# EAGLE design 98x Soldering Station v4.0  (EAGLE 9.6.1)
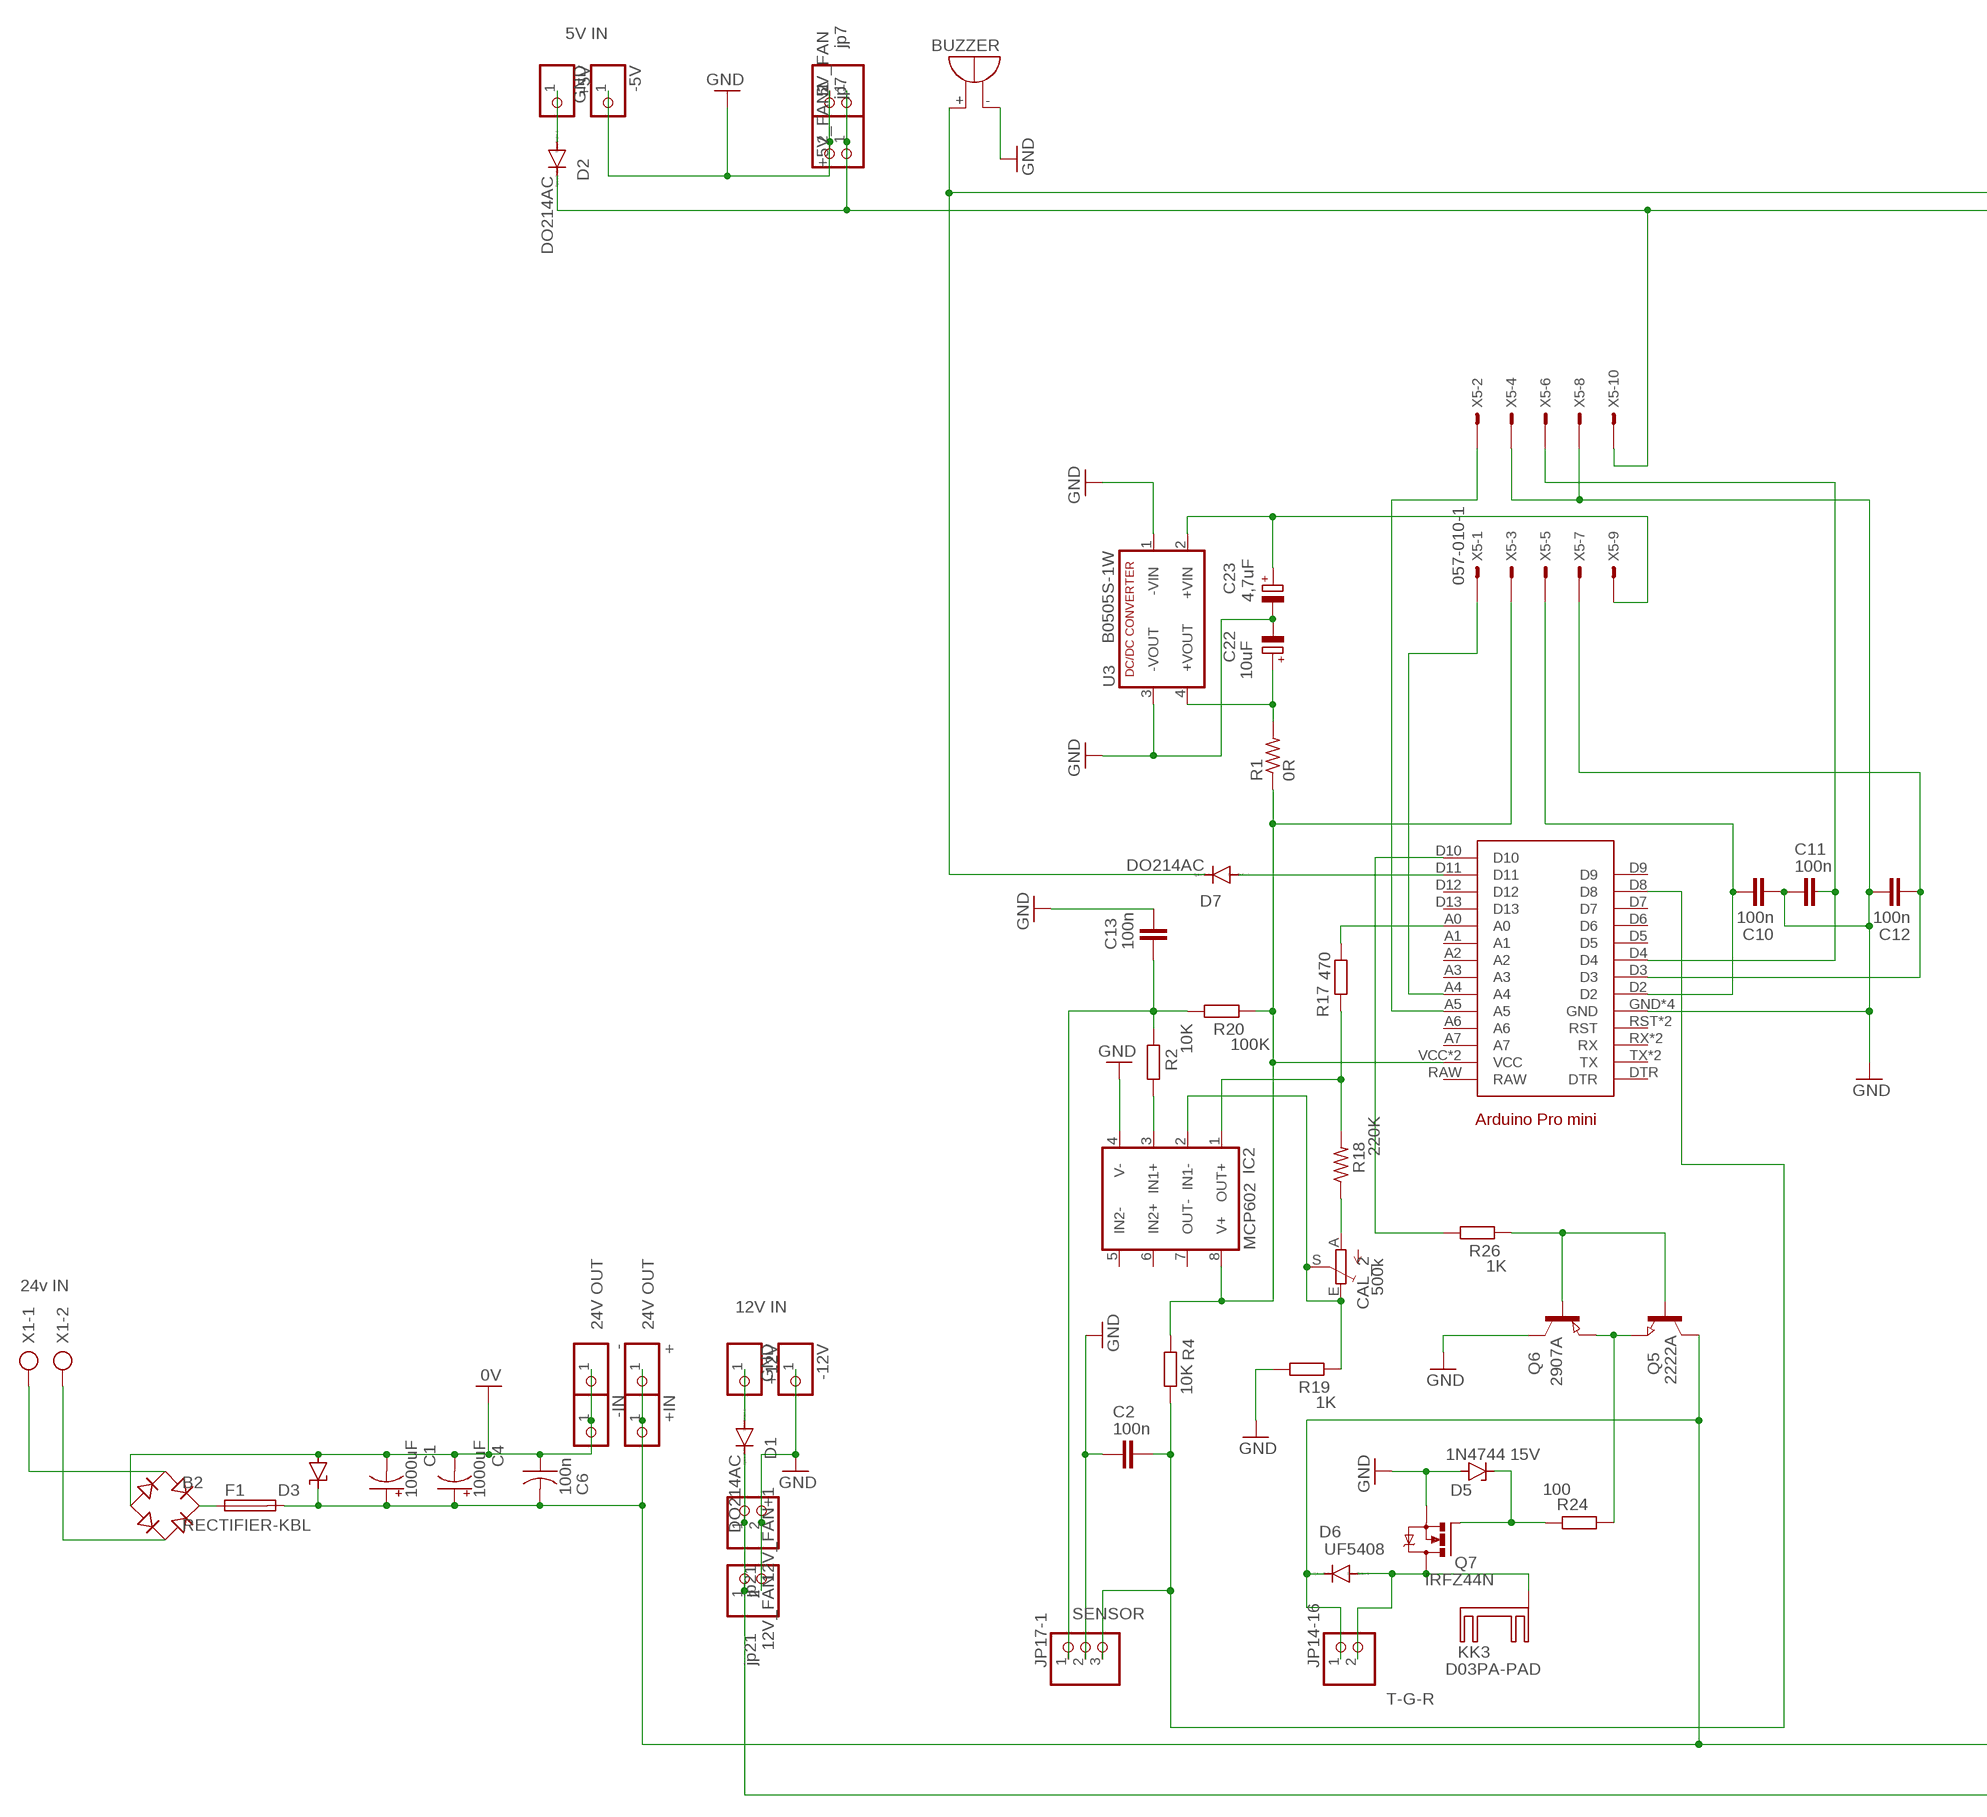
[diagram p0: schematic, sheet 1, part 1 of 2]
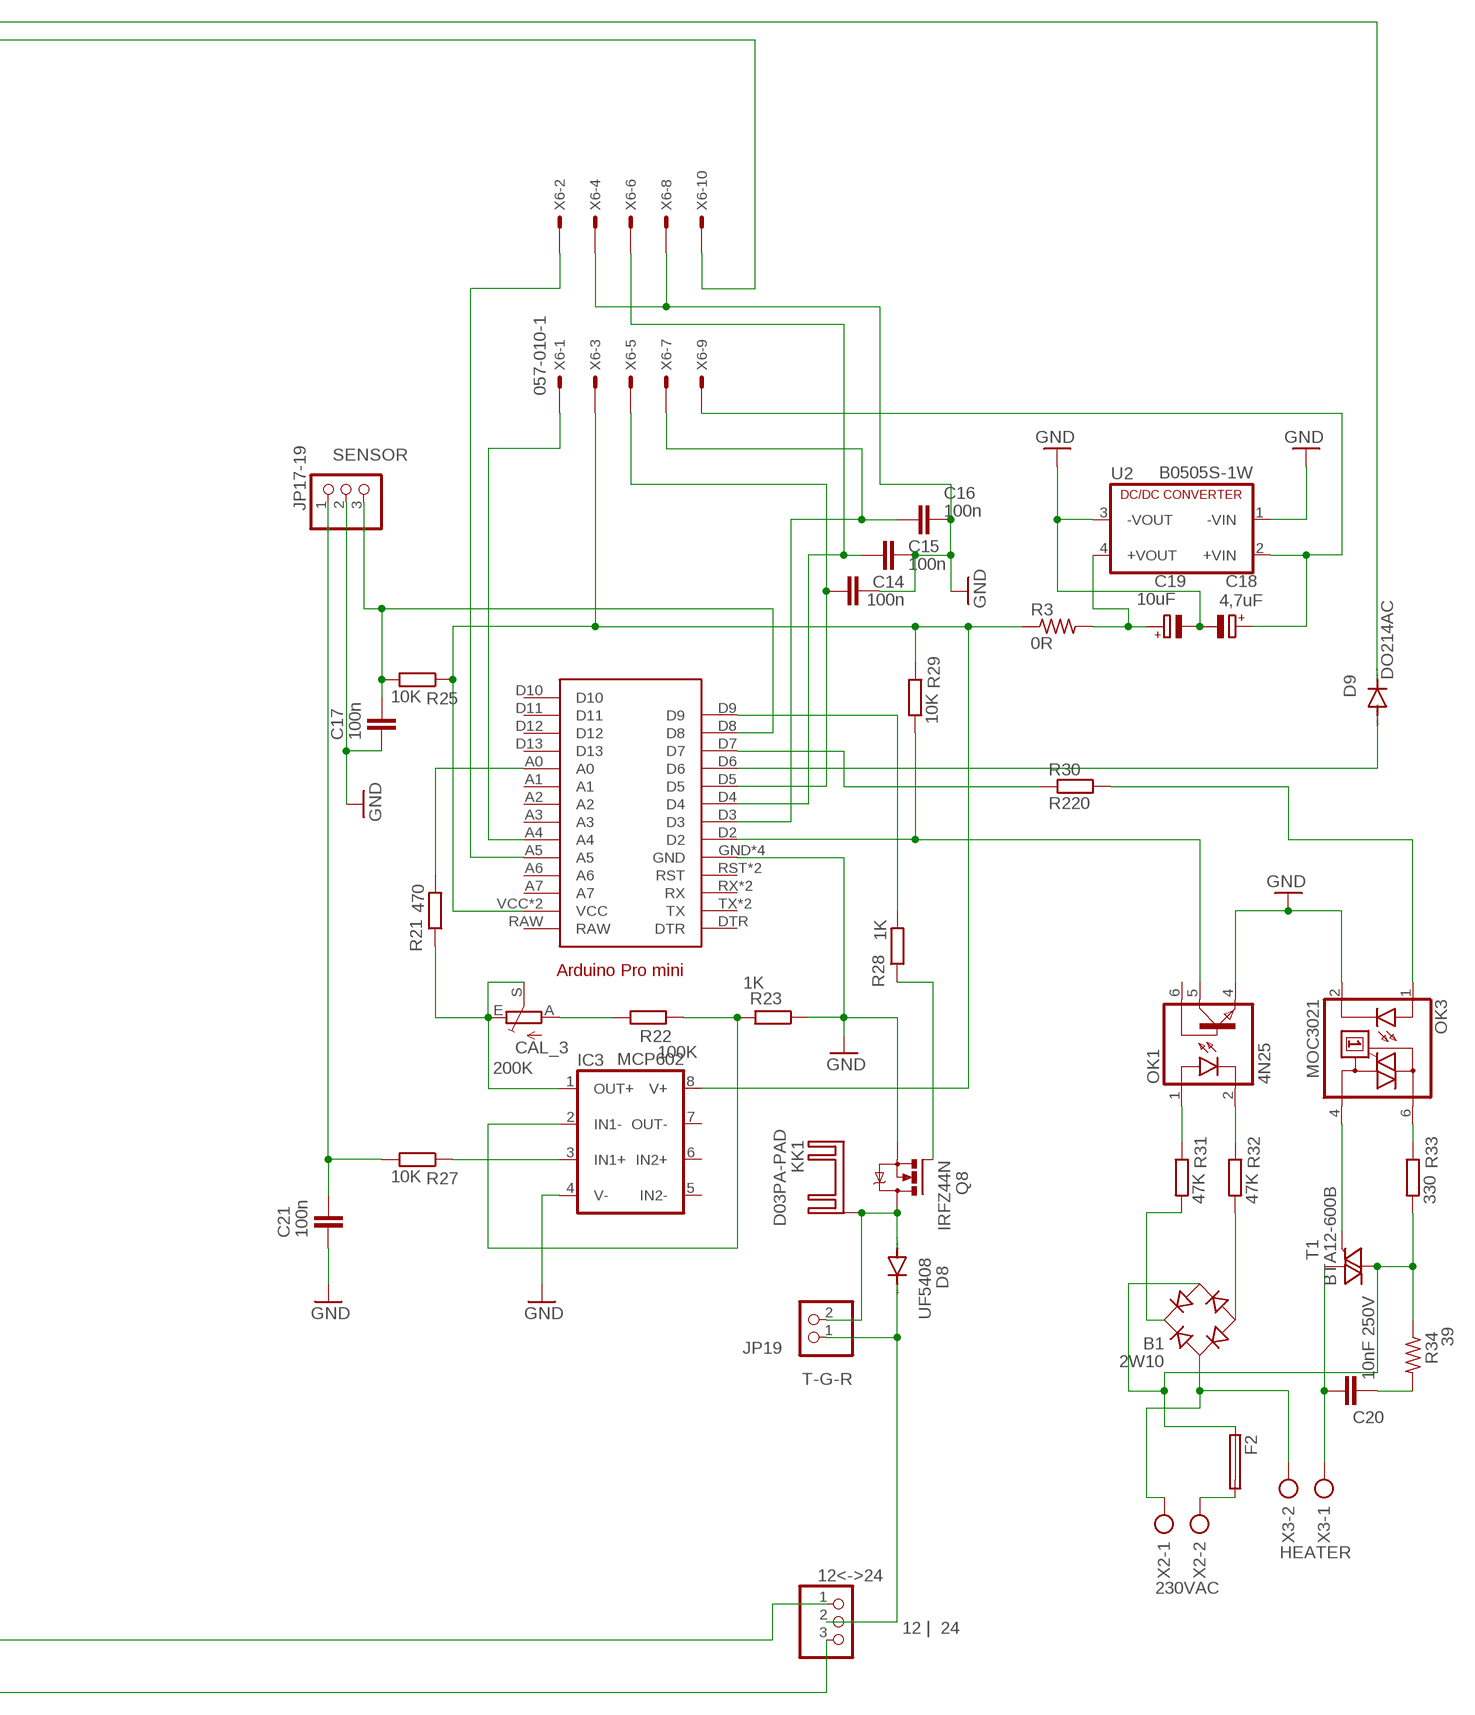
[diagram p1: schematic, sheet 1, part 2 of 2]

## Parts
5V_FAN  jp7  PINHD-1X2  [1X02]
12<->24  12 | 24  PINHD-1X3  [1X03]
12V_FAN  jp21  PINHD-1X2  [1X02]
12V_FAN+1  jp21  PINHD-1X2  [1X02]
+  24V OUT  PINHD-1X1  [1X01]
+5V  5V IN  PINHD-1X1  [1X01]
+5V_FAN1  jp7  PINHD-1X2  [1X02]
+12V  12V IN  PINHD-1X1  [1X01]
+IN  24V OUT  PINHD-1X1  [1X01]
-  GND  PINHD-1X1  [1X01]
-5V  GND  PINHD-1X1  [1X01]
-12V  GND  PINHD-1X1  [1X01]
-IN  GND  PINHD-1X1  [1X01]
ARDUINO2  907 solder  ARDUINO_PRO_MINI  [ARDUINO_PRO_MINI]
ARDUINO3  HotAir  ARDUINO_PRO_MINI  [ARDUINO_PRO_MINI]
B1  2W10  RB1A  [RB1A]
B2  RECTIFIER-KBL  [KBL]
BUZZER  BUZZER  F/TMB  [F/TMB]
C1  1000uF  CPOL-USE5-13  [E5-13]
C2  100n  C-EUC0805  [C0805]
C4  1000uF  CPOL-USE5-13  [E5-13]
C6  100n  C-USC1206K  [C1206K]
C10  100n  C-EUC0805  [C0805]
C11  100n  C-EUC0805  [C0805]
C12  100n  C-EUC0805  [C0805]
C13  100n  C-EUC0805  [C0805]
C14  100n  C-EUC0805  [C0805]
C15  100n  C-EUC0805  [C0805]
C16  100n  C-EUC0805  [C0805]
C17  100n  C-EUC0805  [C0805]
C18  4,7uF  CPOL-EUB/3528-21R  [B/3528-21R]
C19  10uF  CPOL-EUB/3528-21R  [B/3528-21R]
C20  10nF 250V  C10/4  [C10B4]
C21  100n  C-EUC0805  [C0805]
C22  10uF  CPOL-EUB/3528-21R  [B/3528-21R]
C23  4,7uF  CPOL-EUB/3528-21R  [B/3528-21R]
CAL_2  500k  TRIM_EU-S64W  [S64W]
CAL_3  200K  TRIM_EU-S64W  [S64W]
D1  DO214AC  DIODE-DO214AC  [DO214AC]
D2  DO214AC  DIODE-DO214AC  [DO214AC]
D3  SUPPRESSOR-SMBJ  [SMBJ]
D5  1N4744 15V  1N4728  [DO41Z10]
D6  UF5408  DIODE-SMC  [SMC]
D7  DO214AC  DIODE-DO214AC  [DO214AC]
D8  UF5408  DIODE-SMC  [SMC]
D9  DO214AC  DIODE-DO214AC  [DO214AC]
F1  TE5  [TE5]
F2  TE5  [TE5]
IC2  MCP602  [DIL08]
IC3  MCP602  [DIL08]
JP14-16  T-G-R  PINHD-1X2  [1X02]
JP17-1  SENSOR  PINHD-1X3  [1X03]
JP17-19  SENSOR  PINHD-1X3  [1X03]
JP19  T-G-R  PINHD-1X2  [1X02]
KK1  D03PA-PAD  [D03PA-PAD]
KK3  D03PA-PAD  [D03PA-PAD]
OK1  4N25  4N25M  [DIL06]
OK3  MOC3021  MOC3031M  [DIL06]
Q5  2222A  NPN-TRANSISTOR_SOT23  [SOT23]
Q6  2907A  PNP-TRANSISTOR_SOT23  [SOT23]
Q7  IRFZ44N  IRF540  [TO220BV]
Q8  IRFZ44N  IRF540  [TO220BV]
R1  0R  R-US_M0805  [M0805]
R2  10K  R-EU_R0805  [R0805]
R3  0R  R-US_M0805  [M0805]
R4  10K  R-EU_R0805  [R0805]
R17  470  R-EU_R0805  [R0805]
R18  220K  R-US_R0805  [R0805]
R19  1K  R-EU_R0805  [R0805]
R20  100K  R-EU_R0805  [R0805]
R21  470  R-EU_R0805  [R0805]
R22  100K  R-EU_R0805  [R0805]
R23  1K  R-EU_R0805  [R0805]
R24  100  R-EU_R0805  [R0805]
R25  10K  R-EU_R0805  [R0805]
R26  1K  R-EU_R0805  [R0805]
R27  10K  R-EU_R0805  [R0805]
R28  1K  R-EU_R0805  [R0805]
R29  10K  R-EU_R0805  [R0805]
R30  R220  R-EU_R0805  [R0805]
R31  47K  R-EU_M1206  [M1206]
R32  47K  R-EU_M1206  [M1206]
R33  330  R-EU_M1206  [M1206]
R34  39  R-US_0411/15  [0411/15]
T1  BTA12-600B  BT138-V  [TO220BV]
U2  B0505S-1W  VA-0505S  [4SIL]
U3  B0505S-1W  VA-0505S  [4SIL]
X1  24v IN  AK500/2-H  [AK500/2-H]
X2  230VAC  AK500/2-H  [AK500/2-H]
X3  HEATER  AK500/2-H  [AK500/2-H]
X5  057-010-1  [057-010-1]
X6  057-010-1  [057-010-1]

## Nets
0V: -.1 -IN.1 B2.- C1.- C4.- C6.1 D3.A
GND: 5V_FAN.2 12V_FAN+1.2 12V_FAN.2 +5V_FAN1.2 -5V.1 -12V.1 ARDUINO2.GND ARDUINO2.GND@1(GND) ARDUINO2.GND@2(GND) ARDUINO2.GND@3(GND) ARDUINO3.GND ARDUINO3.GND@1(GND) ARDUINO3.GND@2(GND) ARDUINO3.GND@3(GND) BUZZER.- C2.2 C10.2 C11.2 C12.1 C13.1 C14.2 C15.2 C16.2 C17.2 C18.- C19.- C21.2 C22.- C23.- D5.A IC2.4(V-) IC3.4(V-) JP17-1.2 JP17-19.2 OK1.4(EMI) OK3.2(C) Q6.3(C) Q7.S Q8.S R19.1 R23.1 U2.1(-VIN) U2.3(-VOUT) U3.1(-VIN) U3.3(-VOUT) X5.4 X5.8 X6.4 X6.8
N$1: D6.A JP14-16.2 KK3.B(K) Q7.D
N$2: B2.+ F1.1
N$3: 12<->24.3 12V_FAN+1.1 12V_FAN.1 D1.C
N$4: C22.+ R1.2 U3.4(+VOUT)
N$5: C19.+ R3.2 U2.4(+VOUT)
N$6: IC2.3(IN1+) R2.1
N$7: B2.AC2 X1.2
N$8: B2.AC1 X1.1
N$9: F2.2 X2.2
N$11: +12V.1 D1.A
N$12: +5V.1 D2.A
N$14: ARDUINO2.D8 C2.1 JP17-1.3 R4.2
N$15: 12<->24.1 +.1 +IN.1 C1.+ C4.+ C6.2 D3.C D6.C F1.2 JP14-16.1 Q5.3(C)
N$18: ARDUINO2.A4 X5.1
N$19: ARDUINO2.A5 X5.2
N$21: BUZZER.+ D7.C D9.C
N$22: ARDUINO3.D7 R30.2
N$23: ARDUINO2.D3 C12.2 X5.7
N$26: C23.+ U3.2(+VIN) X5.9
N$35: Q5.2(E) Q6.2(E) R24.1
N$38: C18.+ U2.2(+VIN) X6.9
N$39: 12<->24.2 D8.C JP19.1
N$40: 5V_FAN.1 +5V_FAN1.1 D2.C X5.10 X6.10
N$44: IC2.1(OUT+) R17.1 R18.2
N$45: ARDUINO2.D2 C10.1 X5.5
N$46: ARDUINO2.D4 C11.1 X5.6
N$48: ARDUINO2.D11 D7.A
N$51: ARDUINO2.A0 R17.2
N$52: ARDUINO3.A0 R21.2
N$53: CAL_2.A R18.1
N$54: CAL_2.E CAL_2.S IC2.2(IN1-) R19.2
N$55: CAL_3.E CAL_3.S IC3.1(OUT+) R21.1
N$56: C13.2 JP17-1.1 R2.2 R20.1
N$57: ARDUINO2.D10 R26.1
N$58: Q5.1(B) Q6.1(B) R26.2
N$59: D5.C Q7.G R24.2
N$60: CAL_3.A R22.1
N$61: ARDUINO3.D8 C17.1 JP17-19.3 R25.2
N$62: ARDUINO3.D5 C14.1 X6.5
N$63: ARDUINO3.D4 C15.1 X6.6
N$64: ARDUINO3.D3 C16.1 X6.7
N$66: ARDUINO3.A4 X6.1
N$67: ARDUINO3.A5 X6.2
N$68: ARDUINO3.D9 R28.2
N$69: IC3.2(IN1-) R22.2 R23.2
N$70: IC3.3(IN1+) R27.1
N$71: C21.1 JP17-19.1 R27.2
N$72: D8.A JP19.2 KK1.B(K) Q8.D
N$73: OK3.4(A1) T1.G
N$74: Q8.G R28.1
N$75: ARDUINO3.D2 OK1.5(COL) R29.2
N$76: ARDUINO3.D6 D9.A
N$78: ARDUINO3.VCC ARDUINO3.VCC@1(VCC) IC3.8(V+) R3.1 R25.1 R29.1 X6.3
N$79: OK3.1(A) R30.1
N$80: OK3.6(A2) R33.1
N$81: B1.AC2 F2.1 R33.2 R34.1 T1.T2(A2)
N$82: OK1.2(C) R32.1
N$83: OK1.1(A) R31.1
N$84: B1.+ R31.2
N$85: B1.- R32.2
N$86: C20.1 T1.T1(A1) X3.1
N$87: C20.2 R34.2
N$88: B1.AC1 X2.1 X3.2
N$92: ARDUINO2.VCC ARDUINO2.VCC@1(VCC) IC2.8(V+) R1.1 R4.1 R20.2 X5.3
Unconnected: ARDUINO2.A1 ARDUINO2.A2 ARDUINO2.A3 ARDUINO2.A6 ARDUINO2.A7 ARDUINO2.D5 ARDUINO2.D6 ARDUINO2.D7 ARDUINO2.D9 ARDUINO2.D12 ARDUINO2.D13 ARDUINO2.DTR ARDUINO2.RAW ARDUINO2.RST ARDUINO2.RST@1(RST) ARDUINO2.RX ARDUINO2.RX@1(RX) ARDUINO2.TX ARDUINO2.TX@1(TX) ARDUINO3.A1 ARDUINO3.A2 ARDUINO3.A3 ARDUINO3.A6 ARDUINO3.A7 ARDUINO3.D10 ARDUINO3.D11 ARDUINO3.D12 ARDUINO3.D13 ARDUINO3.DTR ARDUINO3.RAW ARDUINO3.RST ARDUINO3.RST@1(RST) ARDUINO3.RX ARDUINO3.RX@1(RX) ARDUINO3.TX ARDUINO3.TX@1(TX) IC2.5(IN2-) IC2.6(IN2+) IC2.7(OUT-) IC3.5(IN2-) IC3.6(IN2+) IC3.7(OUT-) OK1.6(BAS)

## Library data of the parts
5V_FAN 12V_FAN 12V_FAN+1 +5V_FAN1 JP14-16 JP19 = pinhead:PINHD-1X2: PIN HEADER
12<->24 JP17-1 JP17-19 = pinhead:PINHD-1X3: PIN HEADER
+ +5V +12V +IN - -5V -12V -IN = pinhead:PINHD-1X1: PIN HEADER
ARDUINO2 ARDUINO3 = arduinopromini:ARDUINO_PRO_MINI: For creating Arduino Pro Mini shields
B1 = rectifier:RB1A: RECTIFIER 1 A
B2 = rectifier:RECTIFIER-: Rectifier
BUZZER = buzzer:F/TMB: BUZZER Source: Buerklin; OC_FARNELL: unknown; OC_NEWARK: unknown
C1 C4 = rcl:CPOL-US: POLARIZED CAPACITOR, American symbol; SPICEPREFIX: C
C2 C10-C17 C21 = rcl:C-EU: CAPACITOR, European symbol; SPICEPREFIX: C
C6 = rcl:C-US: CAPACITOR, American symbol; SPICEPREFIX: C
C18 C19 C22 C23 = rcl:CPOL-EU: POLARIZED CAPACITOR, European symbol; SPICEPREFIX: C
C20 = capacitor-wima:C: CAPACITOR naming: grid - package width
CAL_2 CAL_3 = pot:TRIM_EU-: POTENTIOMETER
D1 D2 D6-D9 = diode:DIODE-: DIODE
D3 = diode:SUPPRESSOR-: Suppressor diode
D5 = diode:1N4728: Z DIODE 3.3 V, 1W, 5 percent
F1 F2 = fuse:TE5: FUSE Wickmann; OC_FARNELL: unknown; OC_NEWARK: unknown
IC2 IC3 = MCP602dip:MCP602: Single Op Amp 2.7V to 6.0V Single Supply CMOS Source: http://ww1.microchip.com/downloads/en/DeviceDoc/21314g.pdf
KK1 KK3 = heatsink:D03PA-PAD: HEATSINK distributor Schukat
OK1 = optocoupler:4N*?M: General Purpose 6-Pin Phototransistor Optocouplers Source: http://www.fairchildsemi.com/ds/4N/4N35-M.pdf; MPN: 4N25-M; OC_FARNELL: 1021349; OC_NEWARK: 98K9084
OK3 = optocoupler:MOC30*: 6-Pin DIP Zero-Cross Optoisolators Triac Driver Output (250/400 Volt Peak) Source: Data sheet <http://www.fairchildsemi.com/ds/MO/MOC3031M.pdf> The old path of data sheet not more available 2013-05-06.; MF: FAIRCHILD SEMICONDUCTOR; MPN: MOC3031M; OC_FARNELL: 9875964; OC_NEWARK: 78K6089
Q5 = semicon-smd-ipc:NPN-TRANSISTOR_: NPN TRANSISTOR
Q6 = semicon-smd-ipc:PNP-TRANSISTOR_: PNP TRANSISTOR
Q7 Q8 = transistor-power:IRF540: HEXFET Power MOSFET
R1 R3 R18 R34 = rcl:R-US_: RESISTOR, American symbol; SPICEPREFIX: R
R2 R4 R17 R19-R33 = rcl:R-EU_: RESISTOR, European symbol; SPICEPREFIX: R
T1 = triac:BT138: TRIAC Source: http://www.semiconductors.philips.com BT138_SERIES_2.pdf
U2 U3 = dc-dc-converter:VA-*?: DC DC Converter Single Output, 1 Watt Motien Technology Co.,Ltd. Source: Data sheet <http://www.motien.com.tw/data_sheet/VA-1%28H%29.pdf>; OC_FARNELL: unknown; OC_NEWARK: unknown
X1-X3 = con-ptr500:AK500/2-H: CONNECTOR Aug. 2004 / PTR Meßtechnik: Die Bezeichnung der Serie AK505 wurde geändert. Es handelt sich hierbei um AK500 in horizontaler Ausführung.; OC_FARNELL: unknown; OC_NEWARK: unknown
X5 X6 = con-panduit:057-010-: CONNECTOR 10-pin series 057 contact pc board low profile headers; OC_FARNELL: unknown; OC_NEWARK: unknown

## Board
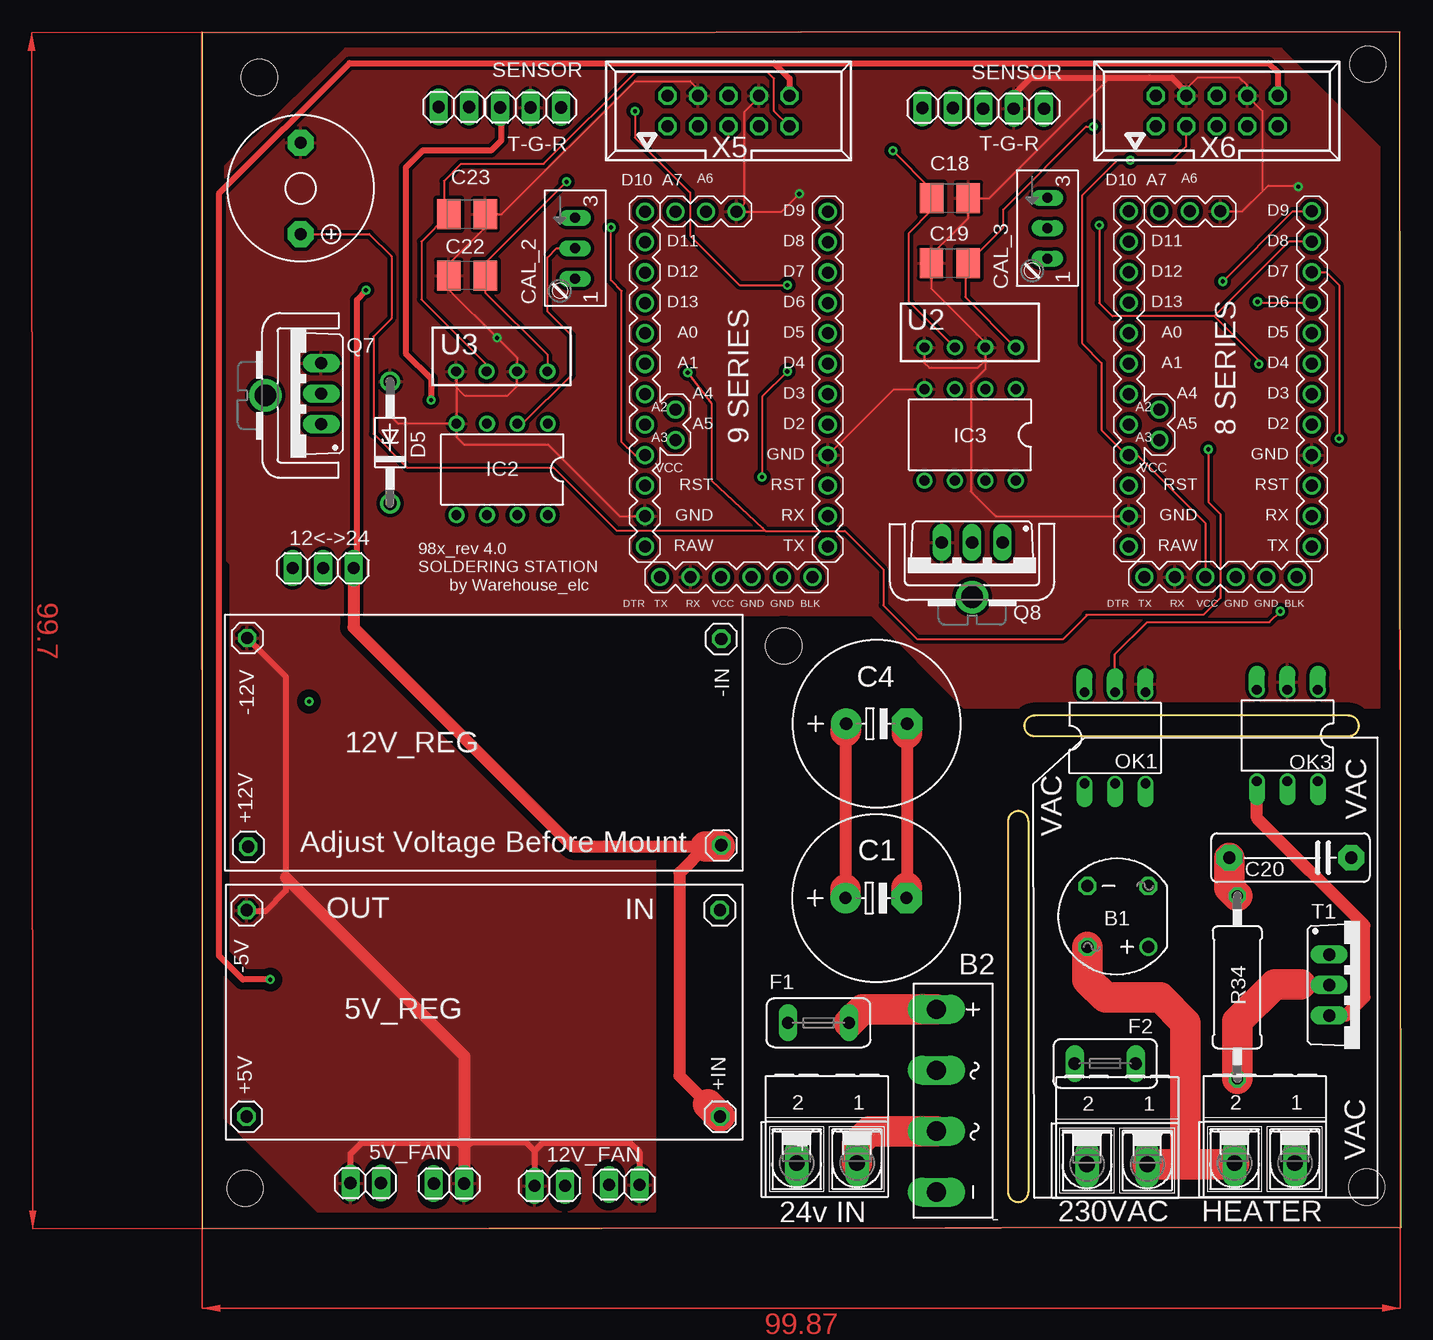
[diagram p2: board, top side]
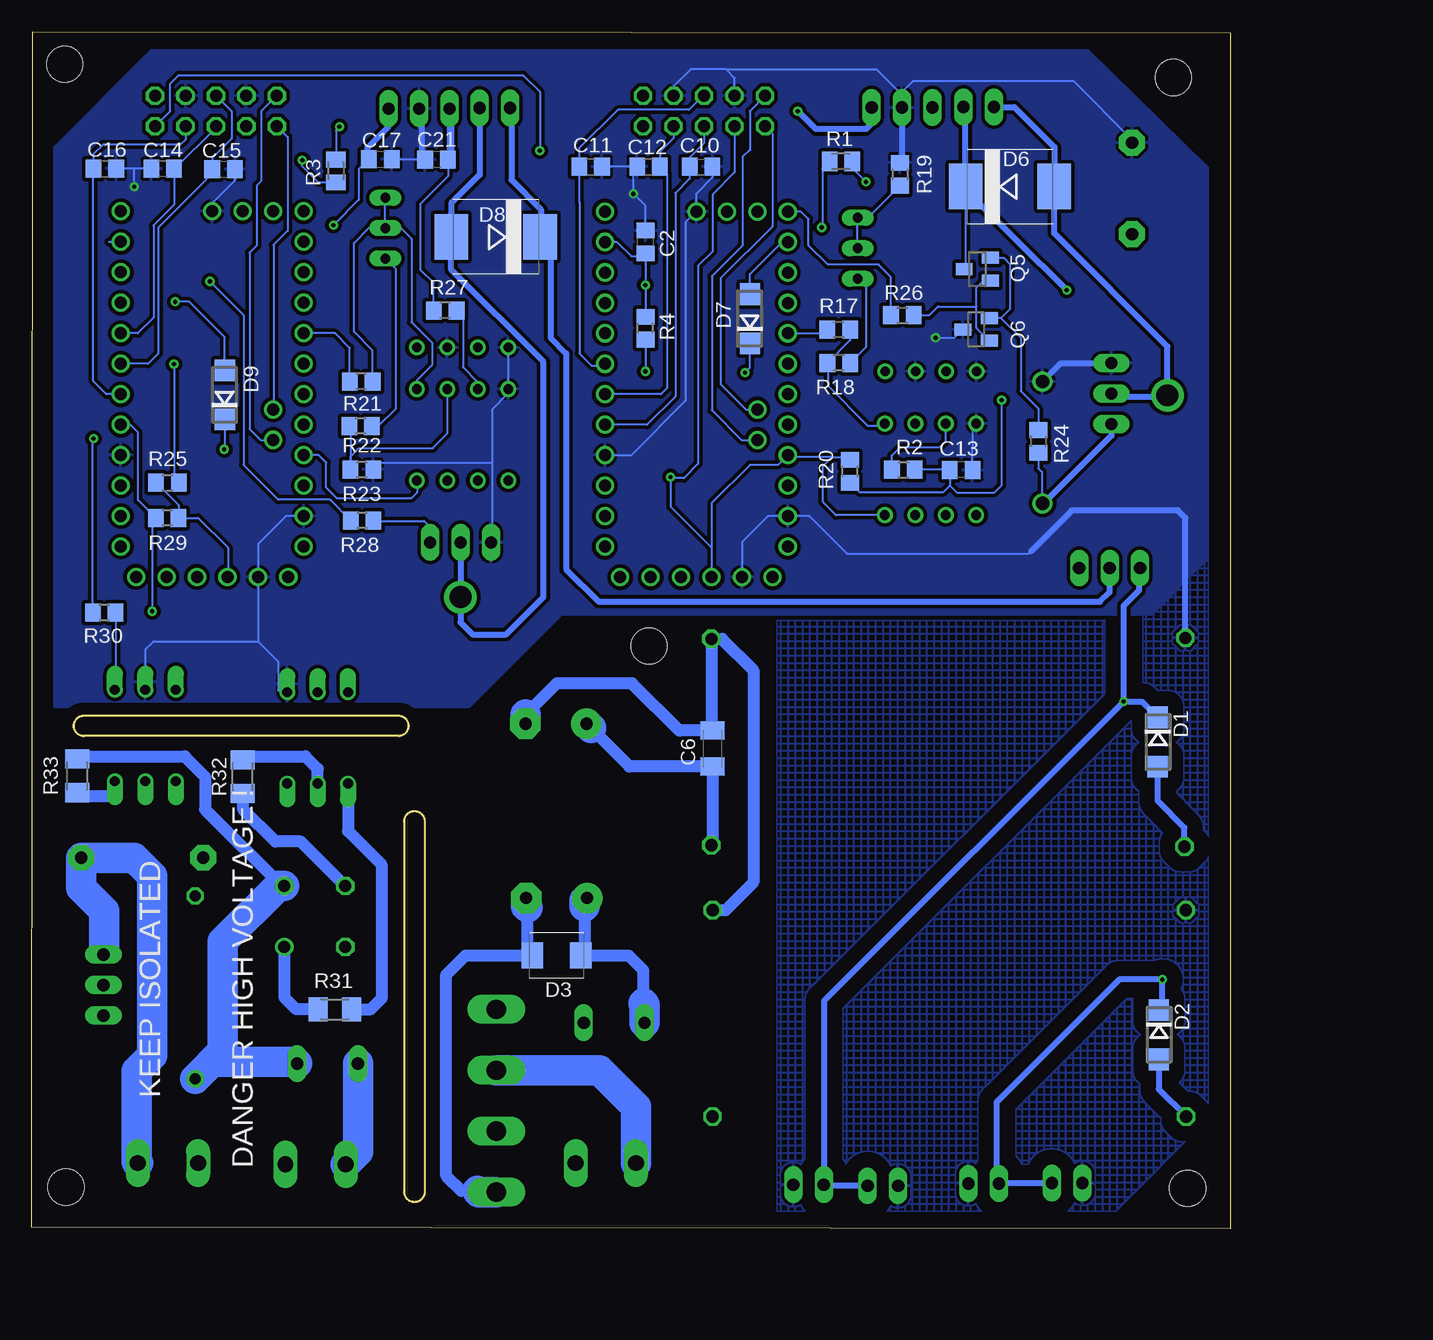
[diagram p3: board, bottom side, seen from below]

Size 99.93 x 99.8 mm. Coordinates in mm from the lower left corner, seen from the top.
Outline: 0,0 99.93,0.1 99.83,99.8 0,99.7 0,0
Outline: 95.56,42.77 69.36,42.77 arc180 69.36,41.07 95.56,41.07 arc180 95.56,42.77
Outline: 68.86,33.97 arc180 67.16,33.97 67.16,3.07 arc180 68.86,3.07 68.86,33.97
Copper layers (1*16): Top 0.035mm / dielectric 1.5mm / Bottom 0.035mm
Design rules "default": minimum track width 6mil, minimum drill 0.35mm, track to track 6mil, track to pad 6mil, pad to pad 6mil, via to via 6mil, smd to smd 6mil, copper to edge 40mil, drill to drill 6mil, minimum pad ring 10mil, minimum via ring 8mil, stop-mask expansion 4mil, vias tented up to drill 0mil, thermal gap 10mil
Holes 3 mm at 4.76,95.97 48.46,48.57 97.06,3.47 3.56,3.37 97.16,97.07

### Footprints (pad centres in the part's own frame; a part is rotated, then mirrored left to right if it is on the bottom)
1X02 = drill 1.016 long: 1 -1.27,0; 2 1.27,0
1X03 = drill 1.016 long: 1 -2.54,0; 2 0,0; 3 2.54,0
1X01 = drill 1.016 octagon: 1 0,0
ARDUINO_PRO_MINI = drill 1: A0 11.43,-8.89; A1 11.43,-6.35; A2 11.43,-3.81; A3 11.43,-1.27; A4 8.89,-2.54; A5 8.89,0; A6 6.35,-19.05; A7 8.89,-19.05; BLK 10.16,11.43; D2 -3.81,-1.27; D3 -3.81,-3.81; D4 -3.81,-6.35; D5 -3.81,-8.89; D6 -3.81,-11.43; D7 -3.81,-13.97; D8 -3.81,-16.51; D9 -3.81,-19.05; D10 11.43,-19.05; D11 11.43,-16.51; D12 11.43,-13.97; D13 11.43,-11.43; DTR -2.54,11.43; GND -3.81,1.27; GND@1 11.43,6.35; GND@2 7.62,11.43; GND@3 3.81,-19.05; RAW 11.43,8.89; RST 11.43,3.81; RST@1 -3.81,3.81; RX -3.81,6.35; RX@1 2.54,11.43; TX -3.81,8.89; TX@1 0,11.43; VCC 11.43,1.27; VCC@1 5.08,11.43
RB1A = drill 1.016: + -2.54,2.54 | drill 1.016 octagon: - 2.54,-2.54; AC1 2.54,2.54; AC2 -2.54,-2.54
KBL = drill 1.6 long: + -7.62,-1.27; - 7.62,-1.27; AC1 2.54,-1.27; AC2 -2.54,-1.27
F/TMB = drill 1.016 pad 2.159 octagon: + 3.81,0; - -3.81,0
E5-13 = drill 1.016 pad 2.54: + -2.54,0 | drill 1.016 pad 2.54 octagon: - 2.54,0
C0805 = smd 1.3 x 1.5: 1 -0.95,0; 2 0.95,0
C1206K = smd 1.5 x 2: 1 -1.5,0; 2 1.5,0
B/3528-21R = smd 1.95 x 2.5: + 1.525,0; - -1.525,0
C10B4 = drill 1.016 pad 2.159 octagon: 1 -5.08,0; 2 5.08,0
S64W = drill 0.813 long: A 2.54,1.27; E -2.54,1.27; S 0,1.27
DO214AC = smd 1.8 x 1.7: A 2.05,0; C -2.05,0
SMBJ = smd 1.78 x 2.16: A 2.04,0; C -2.03,0
DO41Z10 = drill 1.118: A 5.08,0; C -5.08,0
SMC = smd 2.8 x 3.8: A 3.7,0; C -3.7,0
TE5 = drill 1.016 long: 1 -2.54,0; 2 2.54,0
DIL08 = drill 0.813 pad 1.27: 1 -3.81,-3.81; 2 -1.27,-3.81; 3 1.27,-3.81; 4 3.81,-3.81; 5 3.81,3.81; 6 1.27,3.81; 7 -1.27,3.81; 8 -3.81,3.81
D03PA-PAD = drill 1.803 pad 2.54: B 0,-1.016
DIL06 = drill 0.813 offset: 1 -2.54,-3.81; 2 0,-3.81; 3 2.54,-3.81; 4 2.54,3.81; 5 0,3.81; 6 -2.54,3.81
SOT23 = smd 1 x 1.4: 1 -0.95,-1.1; 2 0.95,-1.1; 3 0,1.1
TO220BV = drill 1.016 long: D 0,-2.54; G -2.54,-2.54; S 2.54,-2.54
M0805 = smd 1.3 x 1.6: 1 -0.95,0; 2 0.95,0
R0805 = smd 1.3 x 1.5: 1 -0.95,0; 2 0.95,0
M1206 = smd 1.6 x 2: 1 -1.4,0; 2 1.4,0
0411/15 = drill 0.914 octagon: 1 -7.62,0; 2 7.62,0
TO220BV' = drill 1.016 long: G 2.54,-2.54; T1 -2.54,-2.54; T2 0,-2.54
4SIL = drill 0.8: 1 -3.81,0; 2 -1.27,0; 3 1.27,0; 4 3.81,0
AK500/2-H = drill 1.321 long: 1 -2.515,0; 2 2.515,0
057-010-1 = drill 1 octagon: 1 -5.08,-1.27; 2 -5.08,1.27; 3 -2.54,-1.27; 4 -2.54,1.27; 5 0,-1.27; 6 0,1.27; 7 2.54,-1.27; 8 2.54,1.27; 9 5.08,-1.27; 10 5.08,1.27

### Placement (x,y rotation side)
5V_FAN  13.61,3.8 180 top
12<->24  10.06,55.07 180 top
12V_FAN  28.96,3.57 180 top
12V_FAN+1  35.16,3.67 0 top
+  43.16,9.35 90 top
+5V  3.68,9.35 90 top
+5V_FAN1  20.56,3.77 0 top
+12V  3.82,31.85 90 top
+IN  43.26,31.97 90 top
-  43.14,26.55 90 top
-5V  3.7,26.55 90 top
-12V  3.74,49.25 90 top
-IN  43.26,49.17 90 top
ARDUINO2  48.32,65.75 180 top
ARDUINO3  88.68,65.76 180 top
B1  76.32,26.03 180 top
B2  62.46,10.67 270 top
BUZZER  8.19,86.73 270 top
C1  56.16,27.57 0 top
C2  48.76,82.27 90 bottom
C4  56.21,42.1 0 top
C6  43.15,40.02 270 bottom
C10  44.12,88.52 0 bottom
C11  53.32,88.54 0 bottom
C12  48.5,88.54 0 bottom
C13  22.43,63.26 180 bottom
C14  89,88.35 180 bottom
C15  83.92,88.33 0 bottom
C16  93.82,88.37 0 bottom
C17  70.85,89.17 0 bottom
C18  62.32,85.92 180 top
C19  62.3,80.5 0 top
C20  90.7,30.93 180 top
C21  66.17,89.13 180 bottom
C22  22.06,79.47 0 top
C23  22.06,84.57 180 top
CAL_2  29.8,81.74 270 top
CAL_3  69.17,83.41 270 top
D1  6.06,40.57 270 bottom
D2  5.96,16.17 270 bottom
D3  56.16,22.77 180 bottom
D5  15.65,65.54 90 top
D6  18.37,86.88 0 bottom
D7  40.04,75.86 90 bottom
D8  61.24,82.68 180 bottom
D9  83.82,69.51 90 bottom
F1  51.36,17.17 180 top
F2  75.26,13.77 180 top
IC2  24.99,63.3 180 top
IC3  64,66.18 180 top
JP14-16  20.97,93.51 180 top
JP17-1  27.36,93.47 0 top
JP17-19  67.63,93.38 0 top
JP19  61.3,93.43 0 top
KK1  64.17,53.67 0 top
KK3  6.26,69.47 270 top
OK1  76.08,40.92 0 top
OK3  90.45,41.12 180 top
Q5  21.09,79.99 90 bottom
Q6  21.19,74.97 90 bottom
Q7  7.37,69.61 90 top
Q8  64.17,54.67 180 top
R1  32.46,88.97 0 bottom
R2  27.26,63.27 0 bottom
R3  74.56,88.17 90 bottom
R4  48.76,75.07 90 bottom
R17  32.64,74.95 180 bottom
R18  32.63,72.18 180 bottom
R19  27.53,87.9 270 bottom
R20  31.71,63.14 90 bottom
R21  72.45,70.63 180 bottom
R22  72.5,66.91 180 bottom
R23  72.4,63.27 180 bottom
R24  16,65.63 270 bottom
R25  88.6,62.19 0 bottom
R26  27.34,76.14 0 bottom
R27  65.45,76.55 180 bottom
R28  72.37,59.03 180 bottom
R29  88.62,59.25 180 bottom
R30  93.87,51.35 180 bottom
R31  74.65,18.29 180 bottom
R32  82.32,37.68 270 bottom
R33  96.14,37.75 90 bottom
R34  86.28,20.13 90 top
T1  BTA12-600B  [TO220BV']  96.47,20.31 270 top
U2  64,73.47 0 top
U3  24.96,71.47 0 top
X1  52.06,5.47 180 top
X2  76.26,5.37 180 top
X3  88.56,5.47 180 top
X5  43.86,93.17 0 top
X6  84.56,93.17 0 top

### Tracks (layer width: path | path; a pad name or v marks a point on that pad's centre or on a via)
0V
  Top 1.016: 58.75,41.27 58.75,28.47
  Top 2.54: C1.- 58.7,28.42 58.75,28.47 | C4.- 58.75,41.27
  Bottom 1.016: -.1 42.08,26.55 39.76,28.87 39.76,46.57 42.36,49.17 -IN.1 43.26,41.63 C6.1 45.91,41.52 49.86,45.47 56.16,45.47 58.75,42.88 | 62.76,3.15 64.09,3.15 65.36,4.42 65.36,21.17 63.76,22.77 D3.A 58.6,23.17 58.6,26.77
  Bottom 2.54: 62.76,3.15 62.66,3.05 B2.- | C1.- 58.7,26.87 58.6,26.77 | C4.- 58.75,42.88
GND  (via drill 0.35)
  Top 0.152: 20.66,79.59 20.66,80.52 23.58,83.44 C23.- | C22.- 20.66,79.59 | 20.66,79.59 20.66,78.17 v24.56,74.27 26.23,72.6 U3.3 26.23,70.24 25.46,69.47 21.85,69.47 21.15,70.17 U3.1 21.18,71.44 IC2.4 | 88.36,86.47 88.36,93.18 X6.8 87.1,95.33 86.46,95.97 82.96,95.97 82.02,95.03 82.02,94.97 X6.4 | 88.36,86.47 88.86,86.97 91.26,86.97 v91.36,86.87 | 88.36,86.47 86.7,84.81 ARDUINO3.GND@3 | C19.- 60.47,80.8 | 81.92,94.87 81.92,95.07 | 65.27,72.37 U2.3 65.27,73.87 64.57,74.57 64.56,74.57 60.76,78.37 60.76,80.48 C19.- | 65.27,72.37 65.27,71.67 64.06,70.46 64.06,61.47 66.12,59.41 ARDUINO3.GND@1 | ARDUINO3.GND 92.29,64.69 | 60.26,79.98 C19.- | X5.8 46.4,94.31 45.16,93.07 45.16,85.42 44.51,84.77 ARDUINO2.GND@3 48.29,84.8 v49.76,86.27 | 52.36,64.48 ARDUINO2.GND 57.64,69.99 IC3.4 | C19.- 60.77,81.19 63.84,84.25 C18.- 65.61,85.92 75.66,95.97 78.96,95.97 | IC2.4 21.18,67.07 | D5.A 15.65,67.78 16.32,67.11 IC2.4 | IC2.4 21.18,66.01 21.82,65.37 28.82,65.37 34.79,59.4 ARDUINO2.GND@1 | 24.46,84.57 C23.- | C23.- 24.96,84.57 36.06,95.67 40.66,95.67 41.32,95.01 X5.4 | U2.1 60.19,72.17 60.59,71.77 64.67,71.77 65.27,72.37
  Top 0.508: JP17-19.2 67.63,94.54 69.06,95.97 78.96,95.97 80.82,95.97 81.92,94.87 | 81.92,95.07 82.02,94.97 | -12V.1 6.96,46.03 6.96,29.27 6.96,28.17 5.26,26.47 3.78,26.47 -5V.1 | 27.69,6.5 27.02,7.17 22.4,7.17 21.83,6.6 | 27.69,6.5 28.36,7.17 35.66,7.17 36.43,6.4 12V_FAN+1.2 | 27.69,6.5 12V_FAN.2 | 5V_FAN.2 12.34,6.25 13.26,7.17 21.26,7.17 21.83,6.6 | 21.83,6.6 +5V_FAN1.2
  Top 1.016: 6.96,29.27 21.83,14.4 +5V_FAN1.2
  Bottom 0.152: X5.4 41.32,95.93 42.06,96.67 | 42.06,96.67 44.96,96.67 46.4,95.23 X5.8 | 42.06,96.67 29.51,96.67 27.36,94.52 JP17-1.2 | U2.1 IC3.4 60.19,69.64 61.56,68.27 61.56,63.87 | Q8.S 61.56,57.21 61.56,63.87 | ARDUINO3.GND@1 78.72,59.41 81.06,57.07 ARDUINO3.GND@2 81.06,48.97 | R23.1 70.85,63.87 61.56,63.87 | Q6.3 22.99,74.27 v24.56,74.27 | OK1.4 79.31,45.31 79.36,44.83 79.36,47.27 81.06,48.97 | OK3.2 90.45,48.28 89.76,48.97 81.06,48.97 | 67.86,93.15 JP17-19.2 67.63,94.44 | 67.63,89.64 C21.2 | C21.2 67.17,89.08 | C14.2 91.36,88.35 | 91.36,88.35 92.85,88.35 C16.2 | ARDUINO3.GND@3 84.87,85.51 82.97,87.41 C15.2 | v91.36,86.87 91.36,88.35 | C12.1 49.76,88.54 | 49.76,88.54 C11.2 | C10.2 43.17,87.64 44.51,86.3 ARDUINO2.GND@3 45.41,83.9 45.41,69.02 49.96,64.47 ARDUINO2.GND | 49.76,88.54 v49.76,86.27 48.76,85.27 C2.2 | C13.1 21.45,66.84 IC2.4 | ARDUINO2.GND@2 40.7,57.23 38.53,59.4 ARDUINO2.GND@1 35.09,59.4 31.96,56.27 16.81,56.27 16.61,56.47 | BUZZER.- 8.19,90.8 13.06,95.67 26.46,95.67 27.53,94.6 27.53,94.07 27.53,93.5 | C21.2 69.86,89.13 C17.2
  Bottom 0.508: JP17-19.2 67.43,93.18 67.43,89.34 67.17,89.08 | D5.A 14.12,72.15 Q7.S | -12V.1 3.74,59.25 4.36,59.87 13.21,59.87 16.61,56.47 | R19.1 27.36,89.02 JP17-1.2 27.53,93.64 27.53,94.07
  pour Top (isolate 0.305): 11.88,98.37 1.86,88.58 1.86,55.87 6.56,51.17 55.76,51.17 63.46,43.47 98.16,43.47 98.16,90.17 89.96,98.37
  pour Bottom (isolate 0.305): 11.88,98.27 1.86,88.48 1.86,55.87 6.56,51.17 55.76,51.17 63.46,43.47 98.06,43.47 98.06,90.17 89.96,98.27
  pour Top (isolate 0.61): 1.86,56.37 1.86,9.17 9.56,1.47 37.76,1.47 37.76,51.67 6.56,51.67
  pour Bottom (isolate 1.27, hatched): 1.86,56.37 1.86,9.17 9.56,1.47 37.76,1.47 37.76,51.67 6.56,51.67
N$1
  Bottom 0.152: D6.A 14.67,85.88
  Bottom 0.508: JP14-16.2 18,93.51 14.66,90.17 D6.A 14.67,82.98 5.24,73.55 KK3.B 5.34,69.37 9.67,69.37 Q7.D
N$2
  Top 2.54: F1.1 55.02,18.29 B2.+
N$3  (via drill 0.35)
  Bottom 0.508: 12V_FAN.1 33.79,3.57 | 12V_FAN+1.1 33.86,3.64 33.86,18.98 v8.89,43.95 | 12<->24.3 7.62,54.97 7.62,53.22 8.89,51.95 v8.89,43.95 | D1.C 7.39,43.95 v8.89,43.95
N$4  (via drill 0.35)
  Top 0.152: U3.4 28.77,72.86 23.58,78.05 C22.+ 23.58,80.5 v30.36,87.27
  Bottom 0.152: R1.2 31.51,88.42 v30.36,87.27
N$5  (via drill 0.35)
  Top 0.152: 64.13,80.5 C19.+ | C19.+ 63.59,80.27 63.59,77.66 67.78,73.47 U2.4 | C19.+ 66.76,83.44 66.76,84.97 73.66,91.87 v74.26,91.87
  Bottom 0.152: v74.26,91.87 74.56,91.57 R3.2
N$6
  Bottom 0.152: R2.1 28.21,64.47 27.51,65.17 24.22,65.17 23.72,65.67 IC2.3
N$7
  Bottom 2.54: B2.AC2 52.6,13.21 49.55,10.16 X1.2
N$8
  Top 2.54: X1.1 54.57,7.09 55.62,8.13 B2.AC1
N$9
  Bottom 2.54: F2.2 72.72,6.39 X2.2
N$11
  Bottom 0.508: +12V.1 3.82,33.43 6.06,35.67 D1.A
N$12
  Bottom 0.508: D2.A 5.96,11.63 +5V.1
N$14  (via drill 0.35)
  Top 0.152: v36.06,93.17 36.06,90.97 40.66,86.37 40.66,82.77 44.76,78.67 v48.76,78.67
  Bottom 0.152: R4.2 v48.76,78.67 C2.1 49.02,81.06 49.93,81.06 51.13,82.26 ARDUINO2.D8
  Bottom 0.508: JP17-1.3 29.9,92.13 30.36,91.67 34.56,91.67 v36.06,93.17
N$15  (via drill 0.35)
  Top 0.508: v13.63,78.25 12.86,77.41 12.86,55.67 12.44,55.25 12<->24.1
  Top 1.016: +IN.1 43.16,31.87 | 42.15,10.36 39.76,12.75 39.76,29.67 41.96,31.87 30.86,31.87 12.6,50.13 12<->24.1 | 53.62,41.47 53.62,28.27
  Top 2.54: 41.96,31.87 43.16,31.87 | 42.15,10.36 +.1 | C1.+ 53.62,28.27 | C4.+ 53.67,41.52 53.62,41.47
  Bottom 0.152: 22.16,80.02 Q5.3 22.07,80.11 D6.C
  Bottom 0.508: 22.07,86.67 D6.C 22.07,93.34 JP14-16.1 | 22.07,86.67 22.07,86.63 v13.63,78.25 | 22.16,86.76 22.07,86.67
  Bottom 1.016: +IN.1 43.15,32.08 C6.2 50.09,38.52 53.3,41.73 | 48.92,18.77 48.92,21.53 50.16,22.77 D3.C 53.83,23.07 53.83,26.87
  Bottom 2.54: 48.92,18.77 48.82,18.67 F1.2 | C1.+ 53.83,27.36 53.83,26.87 | C4.+ 53.3,41.73
N$18
  Bottom 0.152: ARDUINO2.A4 40.38,68.29 42.46,70.37 42.46,79.27 38.18,83.55 38.18,91.3 X5.1
N$19
  Bottom 0.152: ARDUINO2.A5 40.74,65.75 43.23,68.24 43.23,79.4 40.66,81.97 40.66,89.37 40.06,89.97 | X5.2 40.06,93.16 40.06,89.97 | 40.06,89.97 40.06,89.87
N$21  (via drill 0.35)
  Top 0.152: 73.76,51.17 83.46,51.17 84.86,52.57 84.86,59.57 83.86,60.57 v83.86,64.97 | 73.76,51.17 73.68,51.17 | v40.46,71.37 42.46,68.78 42.46,62.37 46.7,58.41 | 46.7,58.41 46.96,58.17 34.56,58.17 29.26,63.47 17.06,63.47 14.26,66.27 14.26,74.37 15.76,75.87 15.76,81.07 13.91,82.92 BUZZER.+ | 46.7,58.41 46.94,58.17 53.56,58.17 56.76,54.97 56.76,51.97 59.56,49.17 71.76,49.17 73.76,51.17
  Bottom 0.152: 39.83,73.61 D7.C 40.04,71.79 v40.46,71.37 | D9.C 83.82,65.01 v83.86,64.97
N$22  (via drill 0.35)
  Top 0.152: ARDUINO3.D7 93.69,79.73 94.76,78.66 v94.76,65.87
  Bottom 0.152: R30.2 94.82,65.87 v94.76,65.87
N$23
  Bottom 0.152: ARDUINO2.D3 52.09,69.6 52.06,69.57 47.46,69.57 46.95,70.08 46.95,87.94 C12.2 47.55,89.78 46.4,90.93 X5.7
N$26
  Top 0.152: U3.2 23.69,72.04 18.26,77.47 18.26,82.3 C23.+ 20.13,84.97 20.13,87.34 21.56,88.77 28.46,88.77 36.16,96.47 47.06,96.47 47.66,95.87 47.66,93.18 X5.9
N$35
  Bottom 0.152: Q5.2 18.89,80.94 18.36,80.41 18.36,76.67 19.11,75.92 | 19.11,75.92 Q6.2 | R24.1 16,68.38 17.46,69.84 17.46,74.27 19.11,75.92
N$38  (via drill 0.35)
  Top 0.152: U2.2 58.86,77.34 58.86,82.97 60.79,84.91 C18.+ 60.79,86.63 v57.56,89.87
  Bottom 0.152: X6.9 88.36,93.18 88.36,95.47 87.66,96.17 58.96,96.17 57.56,94.77 v57.56,89.87
N$39
  Bottom 0.508: JP19.1 59.93,93.33 59.93,87.44 57.46,84.97 57.46,82.76 D8.C | D8.C 57.2,82.45 56.66,81.9 56.66,74.27 55.36,72.97 55.36,54.97 52.66,52.27 10.86,52.27 10.06,53.07 12<->24.2 | D8.C 57.26,82.4
N$40  (via drill 0.35)
  Top 0.508: 47.66,97.17 12.26,97.17 1.36,86.27 1.36,22.77 3.36,20.77 v5.66,20.77 | 47.66,97.17 88.86,97.17 89.64,96.39 X6.10 | 47.66,97.17 48.96,95.87 48.96,94.46 X5.10
  Bottom 0.508: 19.26,3.8 19.46,3.8 19.46,10.57 9.26,20.77 v5.66,20.77 5.66,18.52 D2.C | 5V_FAN.1 19.26,3.8 | 19.26,3.8 +5V_FAN1.1
N$44
  Bottom 0.152: 31.56,75.08 R17.1 31.69,74.07 R18.2 33.56,72.16 33.56,70.27 30.26,66.97 28.9,66.97 28.8,67.07 IC2.1
N$45
  Top 0.152: 43.86,91.07 X5.5
  Bottom 0.152: 52.08,67.07 ARDUINO2.D2 48.61,67.02 46.26,69.37 46.26,86.33 45.07,87.52 C10.1 | X5.5 43.86,90.5 45.07,89.29 C10.1 | C10.1
N$46
  Bottom 0.152: ARDUINO2.D4 52.07,72.04 52.14,71.97 53.26,71.97 54.26,72.97 54.26,85.57 54.27,85.58 C11.1 54.27,90.06 51.06,93.27 45.13,93.27 43.96,94.44 X5.6
N$48
  Bottom 0.152: ARDUINO2.D11 37.37,82.26 40.04,79.59 D7.A
N$51
  Bottom 0.152: ARDUINO2.A0 33.9,74.64 R17.2
N$52
  Bottom 0.152: R21.2 73.4,73.41 74.64,74.65 ARDUINO3.A0
N$53
  Top 0.152: 31.53,79.2 CAL_2.A 31.97,79.2 32,79.17
  Bottom 0.152: 31.68,72.79 R18.1 30.38,73.48 30.38,78.51 CAL_2.A
N$54
  Top 0.152: IC2.2 26.7,67.11 30.76,71.17 30.76,74.47 28.76,76.47 28.76,80.97 29.53,81.74 CAL_2.S
  Bottom 0.152: R19.2 30.2,84.28 CAL_2.E CAL_2.S
N$55
  Bottom 0.152: R21.1 71.5,73.21 73.06,74.77 73.06,82.17 71.82,83.41 CAL_3.S | CAL_3.S CAL_3.E | CAL_3.S 69.14,83.41 68.26,82.53 68.26,75.57 66.56,73.87 66.56,71.99 67.81,70.74 IC3.1
N$56  (via drill 0.35)
  Top 0.508: v19.06,69.07 19.06,70.87 16.96,72.97 16.96,88.47 18.36,89.87 24.06,89.87 24.93,90.74 24.93,93.36 JP17-1.1
  Bottom 0.152: v19.06,69.07 19.06,61.98 19.68,61.36 22.78,61.36 23.38,61.96 | R2.2 23.59,63.27 23.42,63.22 C13.2 23.38,61.96 | 23.38,61.96 23.96,61.38 23.96,61.37 30.89,61.37 R20.1
N$57
  Bottom 0.152: ARDUINO2.D10 35.79,84.8 35.16,84.17 35.16,81.97 33.56,80.37 29.32,80.37 28.29,79.34 R26.1
N$58
  Bottom 0.152: Q6.1 21.16,75.09 21.16,76.87 | 21.16,76.87 21.16,78.47 20.59,79.04 Q5.1 | R26.2 25.09,76.14 24.36,76.87 21.16,76.87
N$59
  Bottom 0.152: R24.2 16,63.38 15.7,63.08 15.7,60.51 | 15.7,60.51 15.7,60.31 | 15.7,60.51 D5.C
  Bottom 0.508: Q7.G 9.91,66.1 12.45,63.56 | 12.45,63.56 15.7,60.31 | 12.45,63.56
N$60
  Bottom 0.152: CAL_3.A 69.56,79.99 69.56,68.37 71.02,66.91 R22.1
N$61  (via drill 0.35)
  Top 0.152: ARDUINO3.D8 90.56,82.27 84.36,76.07 | 84.36,76.07 75.86,76.07 74.76,77.17 v74.76,83.67 | v88.06,72.07 88.06,72.37 84.36,76.07
  Bottom 0.152: 87.56,62.28 87.61,62.22 | 87.61,62.22 R25.2 | 93.46,82.27 ARDUINO3.D8 | v88.06,72.07 88.06,62.67 87.61,62.22 | 71.92,89.07 71.82,89.17 C17.1 72.66,88.31 72.66,85.77 v74.76,83.67
  Bottom 0.508: JP17-19.3 70.17,91.88 71.93,90.12 71.92,89.07
N$62
  Bottom 0.152: ARDUINO3.D5 91.08,74.65 89.76,75.97 89.76,83.64 88.05,85.35 C14.1 87.98,88.35 84.56,91.77 X6.5
N$63
  Bottom 0.152: 92.47,72.13 ARDUINO3.D4 90.22,72.11 89.36,72.97 89.36,83.47 85.37,87.46 85.37,88.27 85.31,88.33 C15.1 84.87,89.26 83.26,90.87 83.26,93.14 X6.6
N$64
  Bottom 0.152: 87.06,91.86 X6.7 87.1,90.8 87.53,90.37 93.96,90.37 94.77,89.56 C16.1 94.77,70.65 93.69,69.57 ARDUINO3.D3
N$66
  Bottom 0.152: X6.1 78.58,91 78.58,83.2 79.76,82.02 79.76,68.33 ARDUINO3.A4
N$67
  Bottom 0.152: X6.2 80.78,93.14 80.78,87.34 81.16,86.96 81.16,81.97 81.76,81.37 81.76,66.67 80.85,65.76 ARDUINO3.A5
N$68  (via drill 0.35)
  Top 0.152: v85.06,78.97 90.9,84.81 ARDUINO3.D9
  Bottom 0.152: R28.2 75.06,60.77 79.36,60.77 82.26,63.67 82.26,76.17 v85.06,78.97
N$69
  Bottom 0.152: R22.2 73.35,66.81 R23.2 73.35,64.37 72.65,65.07 66.49,65.07 65.27,66.29 IC3.2
N$70
  Bottom 0.152: IC3.3 62.73,70.59 63.96,71.82 63.96,76.55 R27.1
N$71
  Bottom 0.152: JP17-19.1 64.79,93.08 64.79,89.56 C21.1 | C21.1 65.22,88.87 | C21.1 65.22,87.73 67.52,85.43 67.52,79.97 66.4,78.85 R27.2
  Bottom 0.508: JP17-19.1 65.09,89 65.22,88.87
N$72
  Bottom 0.508: 62.97,93.03 JP19.2 62.57,87.85 64.94,85.48 D8.A 64.94,79.95 57.26,72.27 57.26,52.65 60.36,49.55 63.17,49.55 64.17,50.55 KK1.B Q8.D
N$73
  Top 1.016: T1.G 95.33,17.77 96.86,19.3 96.86,25.27 87.91,34.22 OK3.4
N$74
  Bottom 0.152: Q8.G 66.71,58.51 67.21,59.01 71.4,59.01 R28.1
N$75  (via drill 0.35)
  Top 0.152: OK1.5 76.08,47.89 78.76,50.57 88.96,50.57 v89.86,51.47
  Bottom 0.152: ARDUINO3.D2 91.72,67.03 91.06,66.37 91.06,60.74 R29.2 89.86,58.96 v89.86,51.47
N$76  (via drill 0.35)
  Top 0.152: v87.96,77.27 88.04,77.19 ARDUINO3.D6
  Bottom 0.152: D9.A 83.82,74.31 86.78,77.27 v87.96,77.27
N$78  (via drill 0.35)
  Top 0.152: ARDUINO3.VCC@1 83.6,58.83 77.94,64.49 ARDUINO3.VCC 77.04,64.49 74.96,66.57 74.96,72.17 73.36,73.77 73.36,86.17 76.26,89.07 v77.36,89.07 80.86,89.07 82.02,90.23 X6.3
  Bottom 0.152: R25.1 87.67,60.31 R29.1 86.04,59.25 83.56,56.77 83.56,54.37 ARDUINO3.VCC@1 | IC3.8 67.81,61.37 68.31,60.87 74.46,60.87 75.36,61.77 75.36,63.87 75.98,64.49 ARDUINO3.VCC | R3.1 76.01,87.22 77.36,88.57 v77.36,89.07
N$79
  Bottom 0.152: R30.1 92.92,46.27 OK3.1
N$80
  Bottom 1.016: OK3.6 92.99,36.09 95.88,36.09 R33.1
N$81
  Top 1.016: 91.56,20.37 93.87,20.37 T1.T2
  Top 2.54: R34.1 86.28,17.27 89.38,20.37 91.56,20.37
  Bottom 1.016: 78.86,28.87 B1.AC2 79.06,28.57 85.46,34.97 85.46,37.67 87.16,39.37 95.92,39.37 R33.2
  Bottom 2.54: B1.AC2 79.35,28.57 83.98,23.94 83.98,14.81 R34.1 84.88,13.91 77.94,13.91 F2.1
N$82
  Bottom 1.016: OK1.2 76.08,38.34 77.12,39.38 82.02,39.38 R32.1
N$83
  Bottom 1.016: OK1.1 73.54,33.14 70.75,30.35 70.75,19.19 71.65,18.29 R31.1
N$84
  Bottom 1.016: B1.+ 78.86,19.29 77.86,18.29 R31.2
N$85
  Bottom 1.016: B1.- 77.48,32.27 79.59,32.27 82.32,35 R32.2
N$86
  Bottom 1.016: T1.T1 93.86,22.92 93.86,23.67
  Bottom 2.54: 91.06,5.48 X3.1 91.17,5.57 91.17,13.15 89.86,14.47 89.86,29.42 89.87,29.42 91.38,30.93 C20.1 | 95.73,30.88 C20.1 | C20.1 95.78,28.4 93.86,26.48 93.86,23.67
N$87
  Top 2.54: C20.2 85.62,28.41 R34.2
N$88
  Top 2.54: B1.AC1 73.78,20.75 75.26,19.27 79.86,19.27 81.96,17.17 81.96,5.37 | X2.1 81.96,5.37 | 81.96,5.37 85.94,5.37 X3.2
N$92  (via drill 0.35)
  Top 0.152: 37.55,64.48 ARDUINO2.VCC 36.05,64.48 34.96,65.57 34.96,78.17 34.06,79.07 v34.06,83.47 | v48.76,71.47 46.66,69.37 v46.66,62.67
  Bottom 0.152: IC2.8 32.86,59.49 | 32.86,59.49 32.9,59.49 | 36.49,64.48 ARDUINO2.VCC | 32.86,59.49 33.96,60.59 33.96,63.57 33.21,64.32 | 33.21,64.32 31.94,64.32 R20.2 | 33.21,64.32 36.73,64.32 ARDUINO2.VCC | v34.06,83.47 34.01,83.47 34.01,88.37 R1.1 | ARDUINO2.VCC 37.7,63.67 40.06,63.67 43.24,60.49 43.24,56.77 | 43.24,56.77 ARDUINO2.VCC@1 | R4.1 v48.76,71.47 | v46.66,62.67 46.66,62.57 | 46.66,62.57 46.66,60.19 43.24,56.77 | X5.3 41.32,88.06 43.16,86.22 43.16,81.47 44.36,80.27 44.36,63.77 45.56,62.57 46.66,62.57
(copper drawn outside any net)
  shapes: Top area x2

### Text on the board
tPlace: 9 SERIES | 8 SERIES | 98x_rev 4.0 / SOLDERING STATION / by Warehouse_elc | 12V_REG | VAC | VAC | Adjust Voltage Before Mount | OUT | IN | 5V_REG | VAC
bPlace: KEEP ISOLATED | DANGER HIGH VOLTAGE !
tNames: 230VAC | HEATER